# Altium schematic sheet MCP2551T.SchDoc
size A4; SheetNumber: 2; SheetTotal: 2
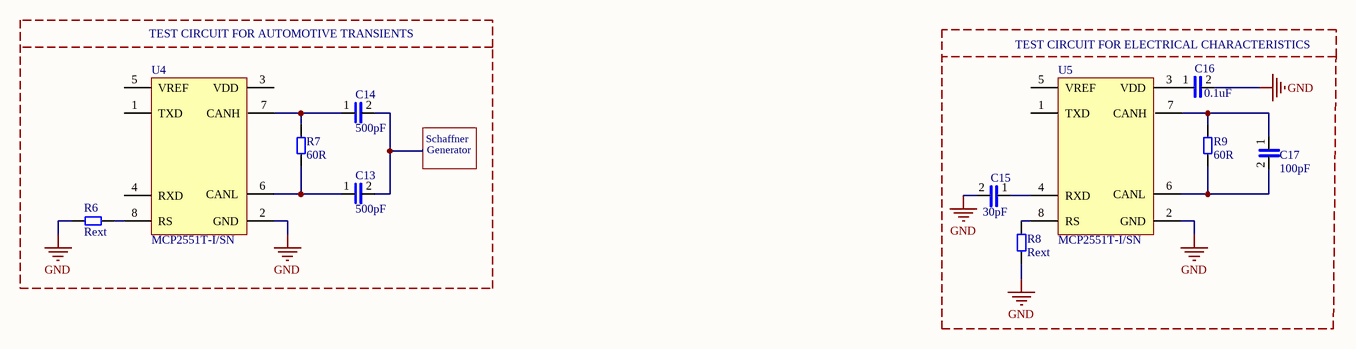
[diagram p0: MCP2551T.SchDoc]

## Parts
C13  500pF  [CAP-0805-NP0]
C14  500pF  [CAP-0805-NP0]
C15  30pF  [CAP-0805-NP0]
C16  0.1uF  [CAP-0805-NP0]
C17  100pF  [CAP-0805-NP0]
R6  Rext  [RES-0805]
R7  60R  [RES-0805]
R8  Rext  [RES-0805]
R9  60R  [RES-0805]
U4  MCP2551T-I/SN  [MCP2551T]
U5  MCP2551T-I/SN  [MCP2551T]

## Nets
GND: C15.2 C16.2 R6.1 R8.1 U4.2(GND) U5.2(GND)
NetC13_1: C13.1 R7.1 U4.6(CANL)
NetC13_2: C13.2 C14.2
NetC14_1: C14.1 R7.2 U4.7(CANH)
NetC15_1: C15.1 U5.4(RXD)
NetC16_1: C16.1 U5.3(VDD)
NetC17_1: C17.1 R9.2 U5.7(CANH)
NetC17_2: C17.2 R9.1 U5.6(CANL)
NetR6_2: R6.2 U4.8(RS)
NetR8_2: R8.2 U5.8(RS)

Not connected (* = marked no-connect by the designer): U4 1(TXD) 3(VDD) 4(RXD) 5(VREF); U5 1(TXD) 5(VREF)

## Notes on the sheet
- TEST CIRCUIT FOR AUTOMOTIVE TRANSIENTS
- TEST CIRCUIT FOR ELECTRICAL CHARACTERISTICS
- Generator
- Schaffner
- (near U4) RS may be connected to VDD or GND
- (near U5) RS may be connected to VDD or GND

## Library data of the parts
C13-C17 = CAP-0805-NP0-3.3nF: CAP CER 3300PF 50V NPO 0805; Manufacturer: Yageo; Manufacturer Part Number: CC0805JKNPO9BN332; Tolerance: 5%; Capacitance: 3.3nF; Dielectric: C0G; Supplier 1: Digi-Key; RoHS: Yes; Category: Ceramic Capacitors; Stock 1: 11274; Pricing 1: 1=0,42000, 10=0,29300, 50=0,20540, 100=0,17600, 500=0,13200, 1000=0,11146 (USD); Mount: Surface Mount; Case/Package: 0805; Min Operating Temperature: -55°C; Max Operating Temperature: 125°C; Packaging: Tape and Reel; Voltage Rating (DC): 50V; Resistor Type: Ceramic; Voltage Rating: 50V; Series: CC; Length: 0.079inch; Width: 0.049inch; Thickness: 0.057inch; Depth: 1.25mm; RoHS Compliant: Yes; ComponentLink1URL: https://datasheet.ciiva.com/13210/upy-gp-np0-16v-to-50v-8-13210153.pdf?src-supplier=Mouser; ComponentLink1Description: https://datasheet.ciiva.com/13210/upy-gp-np0-16v-to-50v-8-13210153.pdf?src-supplier=Mouser; Supplier Part Number 1: 311-4211-1-ND
R6-R9 = RES-0805-10k: Res SMD 0805 10K 1% 0.125W T.C.100PPM; Manufacturer: Yageo; Manufacturer Part Number: RC0805FR-0710KL; Resistance: 10kR; Temperature Coefficient: 100ppm/°C; Power Rating: 125mW; Voltage Rating: 150V; Supplier 1: Digi-Key; RoHS: Yes; Category: Chip SMD Resistors; Stock 1: 1272565; Pricing 1: 5000=0,00544 (USD); Case/Package: 0805; Case Code (Imperial): 0805; Case Code (Metric): 2012; Size Code: 0805; Min Operating Temperature: -55°C; Max Operating Temperature: 155°C; Tolerance: 1%; Resistor Type: Thick Film; Packaging: Tape and Reel; Package Quantity: 1; Termination: SMD/SMT; Number of Terminations: 2; Max Power Dissipation: 125mW; Features: Moisture Resistant; Series: RC; Construction: Rectangular; Resistance Tolerance: 1%; Technology: THICK FILM; Length: 2mm; Width: 0.049inch; Height: 0.024inch; Depth: 1.25mm; REACH SVHC: Unknown; Lead Free: Lead Free; Military Standard: Not; RoHS Compliant: Yes; Supplier Part Number 1: 311-10.0KCRTR-ND
U4 U5 = MCP2551T-I/SN: 1/1 Transceiver Half CAN 8-SOIC; Manufacturer: Microchip; Manufacturer Part Number: MCP2551-I/SN; Number of Terminals/Pins: 8; Package Body Material: Plastic; Interface: CAN,Serial; Operating Supply Voltage: 5V; Data Rate: 1Mbps; Max Supply Voltage: 5.5V; Min Supply Voltage: 4.5V; Nominal Supply Current: 75mA; Number of Transceivers: 1; Slew Rate: 8.5V/µs; Time @ Peak Reflow Temperature-Max (s): 40s; Supplier 1: Arrow Electronics; RoHS: Yes; Category: Interface ICs; Stock 1: 5; Pricing 1: 1=1,81530, 10=1,63500, 25=1,27120 (USD); Mount: Surface Mount; Case/Package: SOIC; Number of Pins: 8; Contact Plating: Tin,Matte; Package Shape: Rectangular; Terminal Finish: Tin; Min Operating Temperature: -40°C; Max Operating Temperature: 85°C; Package Quantity: 100; Packaging: Rail/Tube; Max Supply Current: 75mA; Number of Drivers: 1; Number of Receivers: 1; Supply Current: 75mA; Number of Transmit Buffers: 1; Number of Receive Buffers: 1; Supply Voltage-Nom: 5.5V; Logic Function: Transceiver; Number of Functions: 1; JESD-30 Code: R-PDSO-G8; Moisture Sensitivity Level: 1; Peak Reflow Temperature (Cel): 260°C; Surface Mount: Yes; Terminal Form: Gull Wing; Terminal Position: DUAL; Length: 4.9mm; Width: 3.9mm; Height: 1.25mm; Radiation Hardening: No; REACH SVHC: No SVHC; Lead Free: Lead Free; RoHS Compliant: Yes; Temperature Grade: INDUSTRIAL; ComponentLink1URL: https://datasheet.ciiva.com/27056/2040583-27056423.pdf?src-supplier=Jameco; ComponentLink1Description: https://datasheet.ciiva.com/27056/2040583-27056423.pdf?src-supplier=Jameco; ComponentLink2URL: https://datasheet.ciiva.com/8084/jp011797-8084592.pdf?src-supplier=Avnet; ComponentLink2Description: https://datasheet.ciiva.com/8084/jp011797-8084592.pdf?src-supplier=Avnet; ComponentLink3URL: https://datasheet.ciiva.com/14152/eb644223-644224-e-14152540.pdf?src-supplier=Distrelec; ComponentLink3Description: https://datasheet.ciiva.com/14152/eb644223-644224-e-14152540.pdf?src-supplier=Distrelec; ComponentLink4URL: https://datasheet.ciiva.com/1495/21667f-1495089.pdf?src-supplier=Element14; ComponentLink4Description: https://datasheet.ciiva.com/1495/21667f-1495089.pdf?src-supplier=Element14; ComponentLink5URL: https://datasheet.ciiva.com/1700/21667f-1700023.pdf?src-supplier=Digi-Key; ComponentLink5Description: https://datasheet.ciiva.com/1700/21667f-1700023.pdf?src-supplier=Digi-Key; Supplier Part Number 1: MCP2551-I/SN